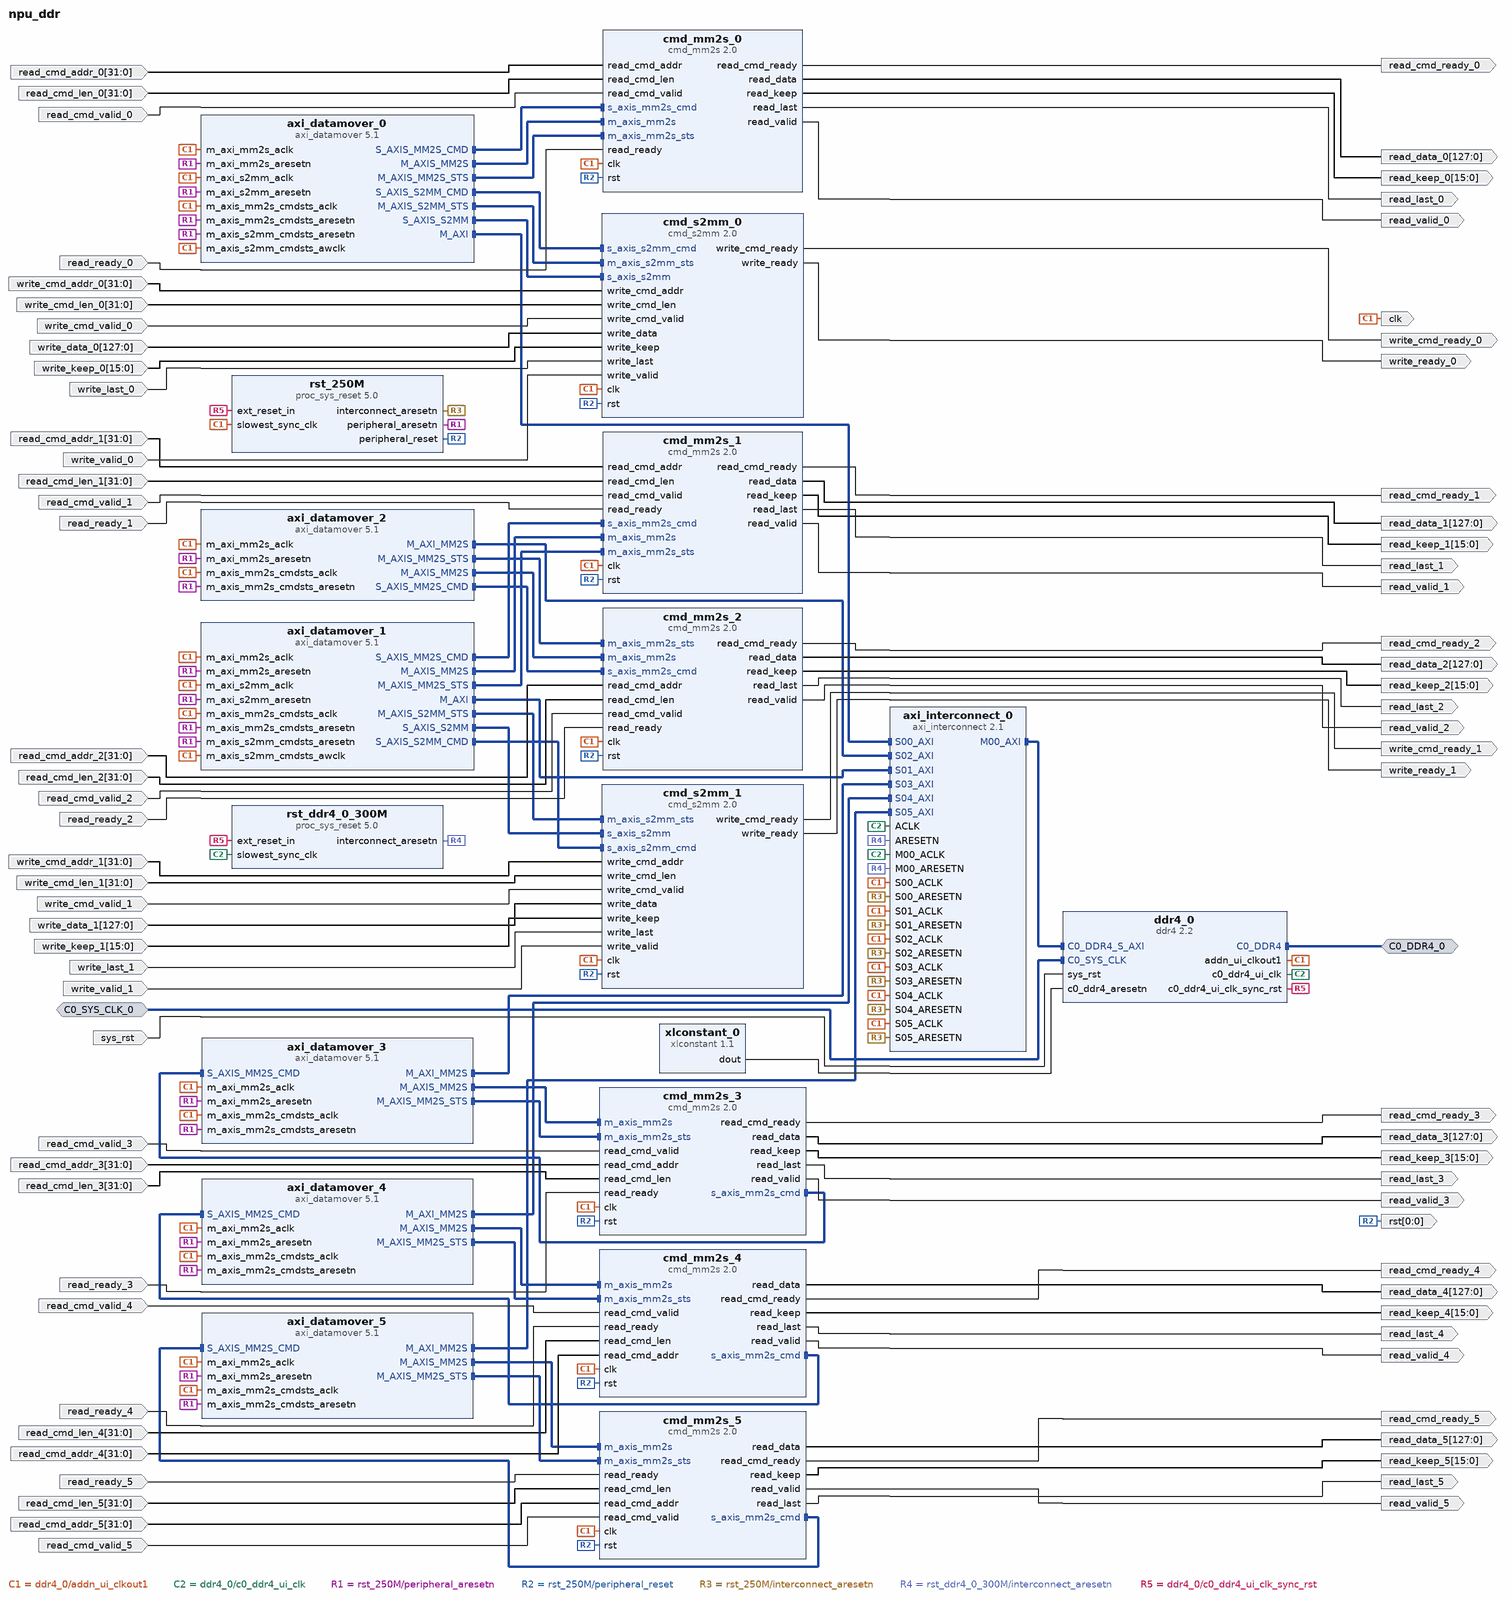
[diagram p0: block diagram of the top level]
# Vivado block design npu_ddr, xczu15eg-ffvb1156-2-i, Vivado 2020.2
create_bd_design npu_ddr

create_bd_intf_port -mode Master -vlnv xilinx.com:interface:ddr4_rtl:1.0 C0_DDR4_0
create_bd_intf_port -mode Slave -vlnv xilinx.com:interface:diff_clock_rtl:1.0 C0_SYS_CLK_0
set_property -dict {CONFIG.FREQ_HZ 200000000} [get_bd_intf_ports C0_SYS_CLK_0]
create_bd_port -dir O -type clk clk
set_property -dict {CONFIG.ASSOCIATED_RESET rst CONFIG.FREQ_HZ 300000000} [get_bd_ports clk]
create_bd_port -dir I -from 31 -to 0 read_cmd_addr_0
create_bd_port -dir I -from 31 -to 0 read_cmd_addr_1
create_bd_port -dir I -from 31 -to 0 read_cmd_addr_2
create_bd_port -dir I -from 31 -to 0 read_cmd_len_0
create_bd_port -dir I -from 31 -to 0 read_cmd_len_1
create_bd_port -dir I -from 31 -to 0 read_cmd_len_2
create_bd_port -dir O read_cmd_ready_0
create_bd_port -dir O read_cmd_ready_1
create_bd_port -dir O read_cmd_ready_2
create_bd_port -dir I read_cmd_valid_0
create_bd_port -dir I read_cmd_valid_1
create_bd_port -dir I read_cmd_valid_2
create_bd_port -dir O -from 127 -to 0 read_data_0
create_bd_port -dir O -from 127 -to 0 read_data_1
create_bd_port -dir O -from 127 -to 0 read_data_2
create_bd_port -dir O -from 15 -to 0 read_keep_0
create_bd_port -dir O -from 15 -to 0 read_keep_1
create_bd_port -dir O -from 15 -to 0 read_keep_2
create_bd_port -dir O read_last_0
create_bd_port -dir O read_last_1
create_bd_port -dir O read_last_2
create_bd_port -dir I read_ready_0
create_bd_port -dir I read_ready_1
create_bd_port -dir I read_ready_2
create_bd_port -dir O read_valid_0
create_bd_port -dir O read_valid_1
create_bd_port -dir O read_valid_2
create_bd_port -dir I -type rst sys_rst
set_property -dict {CONFIG.POLARITY ACTIVE_HIGH} [get_bd_ports sys_rst]
create_bd_port -dir I -from 31 -to 0 write_cmd_addr_0
create_bd_port -dir I -from 31 -to 0 write_cmd_addr_1
create_bd_port -dir I -from 31 -to 0 write_cmd_len_0
create_bd_port -dir I -from 31 -to 0 write_cmd_len_1
create_bd_port -dir O write_cmd_ready_0
create_bd_port -dir O write_cmd_ready_1
create_bd_port -dir I write_cmd_valid_0
create_bd_port -dir I write_cmd_valid_1
create_bd_port -dir I -from 127 -to 0 write_data_0
create_bd_port -dir I -from 127 -to 0 write_data_1
create_bd_port -dir I -from 15 -to 0 write_keep_0
create_bd_port -dir I -from 15 -to 0 write_keep_1
create_bd_port -dir I write_last_0
create_bd_port -dir I write_last_1
create_bd_port -dir O write_ready_0
create_bd_port -dir O write_ready_1
create_bd_port -dir I write_valid_0
create_bd_port -dir I write_valid_1
create_bd_port -dir O -from 0 -to 0 -type rst rst
create_bd_port -dir I read_cmd_valid_3
create_bd_port -dir I -from 31 -to 0 read_cmd_addr_3
create_bd_port -dir I -from 31 -to 0 read_cmd_len_3
create_bd_port -dir I read_ready_3
create_bd_port -dir O read_cmd_ready_3
create_bd_port -dir O -from 127 -to 0 read_data_3
create_bd_port -dir O -from 15 -to 0 read_keep_3
create_bd_port -dir O read_valid_3
create_bd_port -dir O read_last_3
create_bd_port -dir I read_cmd_valid_4
create_bd_port -dir O -from 127 -to 0 read_data_4
create_bd_port -dir I read_ready_4
create_bd_port -dir O -from 15 -to 0 read_keep_4
create_bd_port -dir I -from 31 -to 0 read_cmd_len_4
create_bd_port -dir O read_valid_4
create_bd_port -dir I -from 31 -to 0 read_cmd_addr_4
create_bd_port -dir O read_cmd_ready_4
create_bd_port -dir O read_last_4
create_bd_port -dir O -from 127 -to 0 read_data_5
create_bd_port -dir I read_ready_5
create_bd_port -dir O -from 15 -to 0 read_keep_5
create_bd_port -dir I -from 31 -to 0 read_cmd_len_5
create_bd_port -dir O read_valid_5
create_bd_port -dir I -from 31 -to 0 read_cmd_addr_5
create_bd_port -dir O read_cmd_ready_5
create_bd_port -dir I read_cmd_valid_5
create_bd_port -dir O read_last_5

create_bd_cell -type ip -vlnv xilinx.com:ip:axi_datamover:5.1 axi_datamover_0
set_property -dict [list \
  CONFIG.c_dummy 1 \
  CONFIG.c_enable_cache_user false \
  CONFIG.c_include_mm2s_dre true \
  CONFIG.c_include_s2mm_dre true \
  CONFIG.c_m_axi_mm2s_data_width 128 \
  CONFIG.c_m_axi_s2mm_awid 0 \
  CONFIG.c_m_axi_s2mm_data_width 128 \
  CONFIG.c_m_axis_mm2s_tdata_width 128 \
  CONFIG.c_mm2s_btt_used 23 \
  CONFIG.c_mm2s_burst_size 64 \
  CONFIG.c_mm2s_include_sf false \
  CONFIG.c_s2mm_btt_used 23 \
  CONFIG.c_s2mm_burst_size 64 \
  CONFIG.c_s_axis_s2mm_tdata_width 128 \
  CONFIG.c_single_interface 1 \
] [get_bd_cells axi_datamover_0]
create_bd_cell -type ip -vlnv xilinx.com:ip:axi_datamover:5.1 axi_datamover_1
set_property -dict [list \
  CONFIG.c_dummy 1 \
  CONFIG.c_enable_cache_user false \
  CONFIG.c_include_mm2s_dre true \
  CONFIG.c_include_s2mm_dre true \
  CONFIG.c_m_axi_mm2s_arid 1 \
  CONFIG.c_m_axi_mm2s_data_width 128 \
  CONFIG.c_m_axi_s2mm_awid 1 \
  CONFIG.c_m_axi_s2mm_data_width 128 \
  CONFIG.c_m_axis_mm2s_tdata_width 128 \
  CONFIG.c_mm2s_btt_used 23 \
  CONFIG.c_mm2s_burst_size 64 \
  CONFIG.c_mm2s_include_sf false \
  CONFIG.c_s2mm_btt_used 23 \
  CONFIG.c_s2mm_burst_size 64 \
  CONFIG.c_s_axis_s2mm_tdata_width 128 \
  CONFIG.c_single_interface 1 \
] [get_bd_cells axi_datamover_1]
create_bd_cell -type ip -vlnv xilinx.com:ip:axi_datamover:5.1 axi_datamover_2
set_property -dict [list \
  CONFIG.c_dummy 1 \
  CONFIG.c_enable_cache_user false \
  CONFIG.c_enable_s2mm 0 \
  CONFIG.c_include_mm2s_dre true \
  CONFIG.c_m_axi_mm2s_arid 2 \
  CONFIG.c_m_axi_mm2s_data_width 128 \
  CONFIG.c_m_axis_mm2s_tdata_width 128 \
  CONFIG.c_mm2s_btt_used 23 \
  CONFIG.c_mm2s_burst_size 64 \
  CONFIG.c_mm2s_include_sf false \
] [get_bd_cells axi_datamover_2]
create_bd_cell -type ip -vlnv xilinx.com:ip:axi_interconnect:2.1 axi_interconnect_0
set_property -dict {CONFIG.NUM_MI 1 CONFIG.NUM_SI 6} [get_bd_cells axi_interconnect_0]
create_bd_cell -type ip -vlnv xilinx.com:user:cmd_mm2s:2.0 cmd_mm2s_0
create_bd_cell -type ip -vlnv xilinx.com:user:cmd_mm2s:2.0 cmd_mm2s_1
create_bd_cell -type ip -vlnv xilinx.com:user:cmd_mm2s:2.0 cmd_mm2s_2
create_bd_cell -type ip -vlnv xilinx.com:user:cmd_s2mm:2.0 cmd_s2mm_0
create_bd_cell -type ip -vlnv xilinx.com:user:cmd_s2mm:2.0 cmd_s2mm_1
create_bd_cell -type ip -vlnv xilinx.com:ip:ddr4:2.2 ddr4_0
set_property -dict [list \
  CONFIG.ADDN_UI_CLKOUT1_FREQ_HZ 300 \
  CONFIG.C0.BANK_GROUP_WIDTH 1 \
  CONFIG.C0.DDR4_AxiAddressWidth 31 \
  CONFIG.C0.DDR4_AxiDataWidth 256 \
  CONFIG.C0.DDR4_CasWriteLatency 12 \
  CONFIG.C0.DDR4_DataWidth 32 \
  CONFIG.C0.DDR4_InputClockPeriod 4998 \
  CONFIG.C0.DDR4_MemoryPart MT40A512M16HA-083E \
  CONFIG.C0.DDR4_TimePeriod 833 \
  CONFIG.System_Clock Differential \
] [get_bd_cells ddr4_0]
create_bd_cell -type ip -vlnv xilinx.com:ip:proc_sys_reset:5.0 rst_250M
create_bd_cell -type ip -vlnv xilinx.com:ip:proc_sys_reset:5.0 rst_ddr4_0_300M
create_bd_cell -type ip -vlnv xilinx.com:ip:xlconstant:1.1 xlconstant_0
create_bd_cell -type ip -vlnv xilinx.com:ip:axi_datamover:5.1 axi_datamover_3
set_property -dict [list \
  CONFIG.c_dummy 1 \
  CONFIG.c_enable_cache_user false \
  CONFIG.c_enable_s2mm 0 \
  CONFIG.c_include_mm2s_dre true \
  CONFIG.c_m_axi_mm2s_arid 3 \
  CONFIG.c_m_axi_mm2s_data_width 128 \
  CONFIG.c_m_axis_mm2s_tdata_width 128 \
  CONFIG.c_mm2s_btt_used 23 \
  CONFIG.c_mm2s_burst_size 64 \
  CONFIG.c_mm2s_include_sf false \
] [get_bd_cells axi_datamover_3]
create_bd_cell -type ip -vlnv xilinx.com:user:cmd_mm2s:2.0 cmd_mm2s_3
create_bd_cell -type ip -vlnv xilinx.com:user:cmd_mm2s:2.0 cmd_mm2s_4
create_bd_cell -type ip -vlnv xilinx.com:ip:axi_datamover:5.1 axi_datamover_4
set_property -dict [list \
  CONFIG.c_dummy 1 \
  CONFIG.c_enable_cache_user false \
  CONFIG.c_enable_s2mm 0 \
  CONFIG.c_include_mm2s_dre true \
  CONFIG.c_m_axi_mm2s_arid 4 \
  CONFIG.c_m_axi_mm2s_data_width 128 \
  CONFIG.c_m_axis_mm2s_tdata_width 128 \
  CONFIG.c_mm2s_btt_used 23 \
  CONFIG.c_mm2s_burst_size 64 \
  CONFIG.c_mm2s_include_sf false \
] [get_bd_cells axi_datamover_4]
create_bd_cell -type ip -vlnv xilinx.com:user:cmd_mm2s:2.0 cmd_mm2s_5
create_bd_cell -type ip -vlnv xilinx.com:ip:axi_datamover:5.1 axi_datamover_5
set_property -dict [list \
  CONFIG.c_dummy 1 \
  CONFIG.c_enable_cache_user false \
  CONFIG.c_enable_s2mm 0 \
  CONFIG.c_include_mm2s_dre true \
  CONFIG.c_m_axi_mm2s_arid 5 \
  CONFIG.c_m_axi_mm2s_data_width 128 \
  CONFIG.c_m_axis_mm2s_tdata_width 128 \
  CONFIG.c_mm2s_btt_used 23 \
  CONFIG.c_mm2s_burst_size 64 \
  CONFIG.c_mm2s_include_sf false \
] [get_bd_cells axi_datamover_5]

# ---- connections ----

connect_bd_intf_net [get_bd_intf_pins axi_datamover_2/M_AXIS_MM2S_STS] [get_bd_intf_pins cmd_mm2s_2/m_axis_mm2s_sts]
connect_bd_intf_net [get_bd_intf_pins axi_datamover_2/M_AXIS_MM2S] [get_bd_intf_pins cmd_mm2s_2/m_axis_mm2s]
connect_bd_intf_net [get_bd_intf_pins axi_datamover_0/S_AXIS_S2MM_CMD] [get_bd_intf_pins cmd_s2mm_0/s_axis_s2mm_cmd]
connect_bd_intf_net [get_bd_intf_ports C0_DDR4_0] [get_bd_intf_pins ddr4_0/C0_DDR4]
connect_bd_intf_net [get_bd_intf_pins axi_datamover_0/M_AXIS_S2MM_STS] [get_bd_intf_pins cmd_s2mm_0/m_axis_s2mm_sts]
connect_bd_intf_net [get_bd_intf_pins axi_datamover_1/M_AXIS_S2MM_STS] [get_bd_intf_pins cmd_s2mm_1/m_axis_s2mm_sts]
connect_bd_intf_net [get_bd_intf_pins axi_datamover_2/S_AXIS_MM2S_CMD] [get_bd_intf_pins cmd_mm2s_2/s_axis_mm2s_cmd]
connect_bd_intf_net [get_bd_intf_pins axi_datamover_5/M_AXIS_MM2S] [get_bd_intf_pins cmd_mm2s_5/m_axis_mm2s]
connect_bd_intf_net [get_bd_intf_pins axi_datamover_3/M_AXIS_MM2S] [get_bd_intf_pins cmd_mm2s_3/m_axis_mm2s]
connect_bd_intf_net [get_bd_intf_pins axi_datamover_0/S_AXIS_S2MM] [get_bd_intf_pins cmd_s2mm_0/s_axis_s2mm]
connect_bd_intf_net [get_bd_intf_pins axi_datamover_2/M_AXI_MM2S] [get_bd_intf_pins axi_interconnect_0/S02_AXI]
connect_bd_intf_net -intf_net C0_SYS_CLK_0_1 [get_bd_intf_ports C0_SYS_CLK_0] [get_bd_intf_pins ddr4_0/C0_SYS_CLK]
connect_bd_intf_net [get_bd_intf_pins axi_interconnect_0/M00_AXI] [get_bd_intf_pins ddr4_0/C0_DDR4_S_AXI]
connect_bd_intf_net [get_bd_intf_pins axi_datamover_4/M_AXIS_MM2S] [get_bd_intf_pins cmd_mm2s_4/m_axis_mm2s]
connect_bd_intf_net [get_bd_intf_pins axi_datamover_1/S_AXIS_S2MM] [get_bd_intf_pins cmd_s2mm_1/s_axis_s2mm]
connect_bd_intf_net [get_bd_intf_pins cmd_mm2s_5/s_axis_mm2s_cmd] [get_bd_intf_pins axi_datamover_5/S_AXIS_MM2S_CMD]
connect_bd_intf_net [get_bd_intf_pins axi_datamover_1/S_AXIS_MM2S_CMD] [get_bd_intf_pins cmd_mm2s_1/s_axis_mm2s_cmd]
connect_bd_intf_net [get_bd_intf_pins axi_datamover_5/M_AXI_MM2S] [get_bd_intf_pins axi_interconnect_0/S05_AXI]
connect_bd_intf_net [get_bd_intf_pins cmd_mm2s_3/s_axis_mm2s_cmd] [get_bd_intf_pins axi_datamover_3/S_AXIS_MM2S_CMD]
connect_bd_intf_net [get_bd_intf_pins cmd_mm2s_4/s_axis_mm2s_cmd] [get_bd_intf_pins axi_datamover_4/S_AXIS_MM2S_CMD]
connect_bd_intf_net [get_bd_intf_pins axi_datamover_4/M_AXIS_MM2S_STS] [get_bd_intf_pins cmd_mm2s_4/m_axis_mm2s_sts]
connect_bd_intf_net [get_bd_intf_pins axi_datamover_4/M_AXI_MM2S] [get_bd_intf_pins axi_interconnect_0/S04_AXI]
connect_bd_intf_net [get_bd_intf_pins axi_datamover_5/M_AXIS_MM2S_STS] [get_bd_intf_pins cmd_mm2s_5/m_axis_mm2s_sts]
connect_bd_intf_net [get_bd_intf_pins axi_datamover_1/M_AXIS_MM2S] [get_bd_intf_pins cmd_mm2s_1/m_axis_mm2s]
connect_bd_intf_net [get_bd_intf_pins axi_datamover_0/S_AXIS_MM2S_CMD] [get_bd_intf_pins cmd_mm2s_0/s_axis_mm2s_cmd]
connect_bd_intf_net [get_bd_intf_pins axi_datamover_1/S_AXIS_S2MM_CMD] [get_bd_intf_pins cmd_s2mm_1/s_axis_s2mm_cmd]
connect_bd_intf_net [get_bd_intf_pins axi_datamover_1/M_AXI] [get_bd_intf_pins axi_interconnect_0/S01_AXI]
connect_bd_intf_net [get_bd_intf_pins axi_datamover_3/M_AXI_MM2S] [get_bd_intf_pins axi_interconnect_0/S03_AXI]
connect_bd_intf_net [get_bd_intf_pins axi_datamover_1/M_AXIS_MM2S_STS] [get_bd_intf_pins cmd_mm2s_1/m_axis_mm2s_sts]
connect_bd_intf_net [get_bd_intf_pins axi_datamover_0/M_AXIS_MM2S] [get_bd_intf_pins cmd_mm2s_0/m_axis_mm2s]
connect_bd_intf_net [get_bd_intf_pins axi_datamover_0/M_AXI] [get_bd_intf_pins axi_interconnect_0/S00_AXI]
connect_bd_intf_net [get_bd_intf_pins axi_datamover_3/M_AXIS_MM2S_STS] [get_bd_intf_pins cmd_mm2s_3/m_axis_mm2s_sts]
connect_bd_intf_net [get_bd_intf_pins axi_datamover_0/M_AXIS_MM2S_STS] [get_bd_intf_pins cmd_mm2s_0/m_axis_mm2s_sts]
connect_bd_net [get_bd_pins cmd_mm2s_0/read_cmd_ready] [get_bd_ports read_cmd_ready_0]
connect_bd_net [get_bd_pins cmd_mm2s_0/read_data] [get_bd_ports read_data_0]
connect_bd_net [get_bd_pins cmd_mm2s_0/read_keep] [get_bd_ports read_keep_0]
connect_bd_net [get_bd_pins cmd_mm2s_0/read_last] [get_bd_ports read_last_0]
connect_bd_net [get_bd_pins cmd_mm2s_0/read_valid] [get_bd_ports read_valid_0]
connect_bd_net [get_bd_pins cmd_mm2s_1/read_cmd_ready] [get_bd_ports read_cmd_ready_1]
connect_bd_net [get_bd_pins cmd_mm2s_1/read_data] [get_bd_ports read_data_1]
connect_bd_net [get_bd_pins cmd_mm2s_1/read_keep] [get_bd_ports read_keep_1]
connect_bd_net [get_bd_pins cmd_mm2s_1/read_last] [get_bd_ports read_last_1]
connect_bd_net [get_bd_pins cmd_mm2s_1/read_valid] [get_bd_ports read_valid_1]
connect_bd_net [get_bd_pins cmd_mm2s_2/read_cmd_ready] [get_bd_ports read_cmd_ready_2]
connect_bd_net [get_bd_pins cmd_mm2s_2/read_data] [get_bd_ports read_data_2]
connect_bd_net [get_bd_pins cmd_mm2s_2/read_keep] [get_bd_ports read_keep_2]
connect_bd_net [get_bd_pins cmd_mm2s_2/read_last] [get_bd_ports read_last_2]
connect_bd_net [get_bd_pins cmd_mm2s_2/read_valid] [get_bd_ports read_valid_2]
connect_bd_net [get_bd_pins cmd_s2mm_0/write_cmd_ready] [get_bd_ports write_cmd_ready_0]
connect_bd_net [get_bd_pins cmd_s2mm_0/write_ready] [get_bd_ports write_ready_0]
connect_bd_net [get_bd_pins cmd_s2mm_1/write_cmd_ready] [get_bd_ports write_cmd_ready_1]
connect_bd_net [get_bd_pins cmd_s2mm_1/write_ready] [get_bd_ports write_ready_1]
connect_bd_net [get_bd_pins ddr4_0/addn_ui_clkout1] \
  [get_bd_ports clk] [get_bd_pins axi_datamover_0/m_axi_mm2s_aclk] [get_bd_pins axi_datamover_0/m_axi_s2mm_aclk] \
  [get_bd_pins axi_datamover_0/m_axis_mm2s_cmdsts_aclk] [get_bd_pins axi_datamover_0/m_axis_s2mm_cmdsts_awclk] \
  [get_bd_pins axi_datamover_1/m_axi_mm2s_aclk] [get_bd_pins axi_datamover_1/m_axi_s2mm_aclk] \
  [get_bd_pins axi_datamover_1/m_axis_mm2s_cmdsts_aclk] [get_bd_pins axi_datamover_1/m_axis_s2mm_cmdsts_awclk] \
  [get_bd_pins axi_datamover_2/m_axi_mm2s_aclk] [get_bd_pins axi_datamover_2/m_axis_mm2s_cmdsts_aclk] \
  [get_bd_pins axi_interconnect_0/S00_ACLK] [get_bd_pins axi_interconnect_0/S01_ACLK] \
  [get_bd_pins axi_interconnect_0/S02_ACLK] [get_bd_pins cmd_mm2s_0/clk] [get_bd_pins cmd_mm2s_1/clk] \
  [get_bd_pins cmd_mm2s_2/clk] [get_bd_pins cmd_s2mm_0/clk] [get_bd_pins cmd_s2mm_1/clk] \
  [get_bd_pins rst_250M/slowest_sync_clk] [get_bd_pins cmd_mm2s_3/clk] [get_bd_pins axi_datamover_3/m_axi_mm2s_aclk] \
  [get_bd_pins axi_datamover_3/m_axis_mm2s_cmdsts_aclk] [get_bd_pins axi_interconnect_0/S03_ACLK] \
  [get_bd_pins axi_datamover_4/m_axi_mm2s_aclk] [get_bd_pins axi_datamover_4/m_axis_mm2s_cmdsts_aclk] \
  [get_bd_pins cmd_mm2s_4/clk] [get_bd_pins cmd_mm2s_5/clk] [get_bd_pins axi_datamover_5/m_axi_mm2s_aclk] \
  [get_bd_pins axi_datamover_5/m_axis_mm2s_cmdsts_aclk] [get_bd_pins axi_interconnect_0/S04_ACLK] \
  [get_bd_pins axi_interconnect_0/S05_ACLK]
connect_bd_net [get_bd_pins ddr4_0/c0_ddr4_ui_clk] \
  [get_bd_pins axi_interconnect_0/ACLK] [get_bd_pins axi_interconnect_0/M00_ACLK] \
  [get_bd_pins rst_ddr4_0_300M/slowest_sync_clk]
connect_bd_net -net read_cmd_addr_0_1 [get_bd_ports read_cmd_addr_0] [get_bd_pins cmd_mm2s_0/read_cmd_addr]
connect_bd_net -net read_cmd_addr_1_1 [get_bd_ports read_cmd_addr_1] [get_bd_pins cmd_mm2s_1/read_cmd_addr]
connect_bd_net -net read_cmd_addr_2_1 [get_bd_ports read_cmd_addr_2] [get_bd_pins cmd_mm2s_2/read_cmd_addr]
connect_bd_net -net read_cmd_len_0_1 [get_bd_ports read_cmd_len_0] [get_bd_pins cmd_mm2s_0/read_cmd_len]
connect_bd_net -net read_cmd_len_1_1 [get_bd_ports read_cmd_len_1] [get_bd_pins cmd_mm2s_1/read_cmd_len]
connect_bd_net -net read_cmd_len_2_1 [get_bd_ports read_cmd_len_2] [get_bd_pins cmd_mm2s_2/read_cmd_len]
connect_bd_net -net read_cmd_valid_0_1 [get_bd_ports read_cmd_valid_0] [get_bd_pins cmd_mm2s_0/read_cmd_valid]
connect_bd_net -net read_cmd_valid_1_1 [get_bd_ports read_cmd_valid_1] [get_bd_pins cmd_mm2s_1/read_cmd_valid]
connect_bd_net -net read_cmd_valid_2_1 [get_bd_ports read_cmd_valid_2] [get_bd_pins cmd_mm2s_2/read_cmd_valid]
connect_bd_net -net read_ready_0_1 [get_bd_ports read_ready_0] [get_bd_pins cmd_mm2s_0/read_ready]
connect_bd_net -net read_ready_1_1 [get_bd_ports read_ready_1] [get_bd_pins cmd_mm2s_1/read_ready]
connect_bd_net -net read_ready_2_1 [get_bd_ports read_ready_2] [get_bd_pins cmd_mm2s_2/read_ready]
connect_bd_net -net reset_rtl_0_1 [get_bd_ports sys_rst] [get_bd_pins ddr4_0/sys_rst]
connect_bd_net [get_bd_pins rst_250M/peripheral_aresetn] \
  [get_bd_pins axi_datamover_0/m_axi_mm2s_aresetn] [get_bd_pins axi_datamover_0/m_axi_s2mm_aresetn] \
  [get_bd_pins axi_datamover_0/m_axis_mm2s_cmdsts_aresetn] [get_bd_pins axi_datamover_0/m_axis_s2mm_cmdsts_aresetn] \
  [get_bd_pins axi_datamover_1/m_axi_mm2s_aresetn] [get_bd_pins axi_datamover_1/m_axi_s2mm_aresetn] \
  [get_bd_pins axi_datamover_1/m_axis_mm2s_cmdsts_aresetn] [get_bd_pins axi_datamover_1/m_axis_s2mm_cmdsts_aresetn] \
  [get_bd_pins axi_datamover_2/m_axi_mm2s_aresetn] [get_bd_pins axi_datamover_2/m_axis_mm2s_cmdsts_aresetn] \
  [get_bd_pins axi_datamover_3/m_axi_mm2s_aresetn] [get_bd_pins axi_datamover_3/m_axis_mm2s_cmdsts_aresetn] \
  [get_bd_pins axi_datamover_4/m_axi_mm2s_aresetn] [get_bd_pins axi_datamover_4/m_axis_mm2s_cmdsts_aresetn] \
  [get_bd_pins axi_datamover_5/m_axi_mm2s_aresetn] [get_bd_pins axi_datamover_5/m_axis_mm2s_cmdsts_aresetn]
connect_bd_net [get_bd_pins rst_250M/peripheral_reset] \
  [get_bd_pins cmd_mm2s_0/rst] [get_bd_pins cmd_mm2s_1/rst] [get_bd_pins cmd_mm2s_2/rst] [get_bd_pins cmd_s2mm_0/rst] \
  [get_bd_pins cmd_s2mm_1/rst] [get_bd_ports rst] [get_bd_pins cmd_mm2s_3/rst] [get_bd_pins cmd_mm2s_4/rst] \
  [get_bd_pins cmd_mm2s_5/rst]
connect_bd_net -net rst_ddr4_0_250M1_interconnect_aresetn [get_bd_pins rst_250M/interconnect_aresetn] \
  [get_bd_pins axi_interconnect_0/S00_ARESETN] [get_bd_pins axi_interconnect_0/S01_ARESETN] \
  [get_bd_pins axi_interconnect_0/S02_ARESETN] [get_bd_pins axi_interconnect_0/S03_ARESETN] \
  [get_bd_pins axi_interconnect_0/S04_ARESETN] [get_bd_pins axi_interconnect_0/S05_ARESETN]
connect_bd_net [get_bd_pins rst_ddr4_0_300M/interconnect_aresetn] \
  [get_bd_pins axi_interconnect_0/ARESETN] [get_bd_pins axi_interconnect_0/M00_ARESETN]
connect_bd_net -net write_cmd_addr_0_1 [get_bd_ports write_cmd_addr_0] [get_bd_pins cmd_s2mm_0/write_cmd_addr]
connect_bd_net -net write_cmd_addr_1_1 [get_bd_ports write_cmd_addr_1] [get_bd_pins cmd_s2mm_1/write_cmd_addr]
connect_bd_net -net write_cmd_len_0_1 [get_bd_ports write_cmd_len_0] [get_bd_pins cmd_s2mm_0/write_cmd_len]
connect_bd_net -net write_cmd_len_1_1 [get_bd_ports write_cmd_len_1] [get_bd_pins cmd_s2mm_1/write_cmd_len]
connect_bd_net -net write_cmd_valid_0_1 [get_bd_ports write_cmd_valid_0] [get_bd_pins cmd_s2mm_0/write_cmd_valid]
connect_bd_net -net write_cmd_valid_1_1 [get_bd_ports write_cmd_valid_1] [get_bd_pins cmd_s2mm_1/write_cmd_valid]
connect_bd_net -net write_data_0_1 [get_bd_ports write_data_0] [get_bd_pins cmd_s2mm_0/write_data]
connect_bd_net -net write_data_1_1 [get_bd_ports write_data_1] [get_bd_pins cmd_s2mm_1/write_data]
connect_bd_net -net write_keep_0_1 [get_bd_ports write_keep_0] [get_bd_pins cmd_s2mm_0/write_keep]
connect_bd_net -net write_keep_1_1 [get_bd_ports write_keep_1] [get_bd_pins cmd_s2mm_1/write_keep]
connect_bd_net -net write_last_0_1 [get_bd_ports write_last_0] [get_bd_pins cmd_s2mm_0/write_last]
connect_bd_net -net write_last_1_1 [get_bd_ports write_last_1] [get_bd_pins cmd_s2mm_1/write_last]
connect_bd_net -net write_valid_0_1 [get_bd_ports write_valid_0] [get_bd_pins cmd_s2mm_0/write_valid]
connect_bd_net -net write_valid_1_1 [get_bd_ports write_valid_1] [get_bd_pins cmd_s2mm_1/write_valid]
connect_bd_net [get_bd_pins xlconstant_0/dout] [get_bd_pins ddr4_0/c0_ddr4_aresetn]
connect_bd_net [get_bd_pins ddr4_0/c0_ddr4_ui_clk_sync_rst] [get_bd_pins rst_ddr4_0_300M/ext_reset_in] [get_bd_pins rst_250M/ext_reset_in]
connect_bd_net -net read_cmd_valid_3_1 [get_bd_ports read_cmd_valid_3] [get_bd_pins cmd_mm2s_3/read_cmd_valid]
connect_bd_net -net read_cmd_addr_3_1 [get_bd_ports read_cmd_addr_3] [get_bd_pins cmd_mm2s_3/read_cmd_addr]
connect_bd_net -net read_cmd_len_3_1 [get_bd_ports read_cmd_len_3] [get_bd_pins cmd_mm2s_3/read_cmd_len]
connect_bd_net -net read_ready_3_1 [get_bd_ports read_ready_3] [get_bd_pins cmd_mm2s_3/read_ready]
connect_bd_net [get_bd_pins cmd_mm2s_3/read_cmd_ready] [get_bd_ports read_cmd_ready_3]
connect_bd_net [get_bd_pins cmd_mm2s_3/read_data] [get_bd_ports read_data_3]
connect_bd_net [get_bd_pins cmd_mm2s_3/read_keep] [get_bd_ports read_keep_3]
connect_bd_net [get_bd_pins cmd_mm2s_3/read_valid] [get_bd_ports read_valid_3]
connect_bd_net [get_bd_pins cmd_mm2s_3/read_last] [get_bd_ports read_last_3]
connect_bd_net -net read_cmd_valid_4_1 [get_bd_ports read_cmd_valid_4] [get_bd_pins cmd_mm2s_4/read_cmd_valid]
connect_bd_net [get_bd_pins cmd_mm2s_4/read_data] [get_bd_ports read_data_4]
connect_bd_net -net read_ready_4_1 [get_bd_ports read_ready_4] [get_bd_pins cmd_mm2s_4/read_ready]
connect_bd_net [get_bd_pins cmd_mm2s_4/read_keep] [get_bd_ports read_keep_4]
connect_bd_net -net read_cmd_len_4_1 [get_bd_ports read_cmd_len_4] [get_bd_pins cmd_mm2s_4/read_cmd_len]
connect_bd_net [get_bd_pins cmd_mm2s_4/read_valid] [get_bd_ports read_valid_4]
connect_bd_net -net read_cmd_addr_4_1 [get_bd_ports read_cmd_addr_4] [get_bd_pins cmd_mm2s_4/read_cmd_addr]
connect_bd_net [get_bd_pins cmd_mm2s_4/read_cmd_ready] [get_bd_ports read_cmd_ready_4]
connect_bd_net [get_bd_pins cmd_mm2s_4/read_last] [get_bd_ports read_last_4]
connect_bd_net [get_bd_pins cmd_mm2s_5/read_data] [get_bd_ports read_data_5]
connect_bd_net -net read_ready_5_1 [get_bd_ports read_ready_5] [get_bd_pins cmd_mm2s_5/read_ready]
connect_bd_net [get_bd_pins cmd_mm2s_5/read_keep] [get_bd_ports read_keep_5]
connect_bd_net -net read_cmd_len_5_1 [get_bd_ports read_cmd_len_5] [get_bd_pins cmd_mm2s_5/read_cmd_len]
connect_bd_net [get_bd_pins cmd_mm2s_5/read_valid] [get_bd_ports read_valid_5]
connect_bd_net -net read_cmd_addr_5_1 [get_bd_ports read_cmd_addr_5] [get_bd_pins cmd_mm2s_5/read_cmd_addr]
connect_bd_net [get_bd_pins cmd_mm2s_5/read_cmd_ready] [get_bd_ports read_cmd_ready_5]
connect_bd_net -net read_cmd_valid_5_1 [get_bd_ports read_cmd_valid_5] [get_bd_pins cmd_mm2s_5/read_cmd_valid]
connect_bd_net [get_bd_pins cmd_mm2s_5/read_last] [get_bd_ports read_last_5]

# ---- address map ----
assign_bd_address -offset 0x80000000 -range 2G -target_address_space [get_bd_addr_spaces axi_datamover_0/Data] [get_bd_addr_segs ddr4_0/C0_DDR4_MEMORY_MAP/C0_DDR4_ADDRESS_BLOCK]
assign_bd_address -offset 0x80000000 -range 2G -target_address_space [get_bd_addr_spaces axi_datamover_1/Data] [get_bd_addr_segs ddr4_0/C0_DDR4_MEMORY_MAP/C0_DDR4_ADDRESS_BLOCK]
assign_bd_address -offset 0x80000000 -range 2G -target_address_space [get_bd_addr_spaces axi_datamover_2/Data_MM2S] [get_bd_addr_segs ddr4_0/C0_DDR4_MEMORY_MAP/C0_DDR4_ADDRESS_BLOCK]
assign_bd_address -offset 0x80000000 -range 2G -target_address_space [get_bd_addr_spaces axi_datamover_3/Data_MM2S] [get_bd_addr_segs ddr4_0/C0_DDR4_MEMORY_MAP/C0_DDR4_ADDRESS_BLOCK]
assign_bd_address -offset 0x80000000 -range 2G -target_address_space [get_bd_addr_spaces axi_datamover_4/Data_MM2S] [get_bd_addr_segs ddr4_0/C0_DDR4_MEMORY_MAP/C0_DDR4_ADDRESS_BLOCK]
assign_bd_address -offset 0x80000000 -range 2G -target_address_space [get_bd_addr_spaces axi_datamover_5/Data_MM2S] [get_bd_addr_segs ddr4_0/C0_DDR4_MEMORY_MAP/C0_DDR4_ADDRESS_BLOCK]

validate_bd_design
save_bd_design
